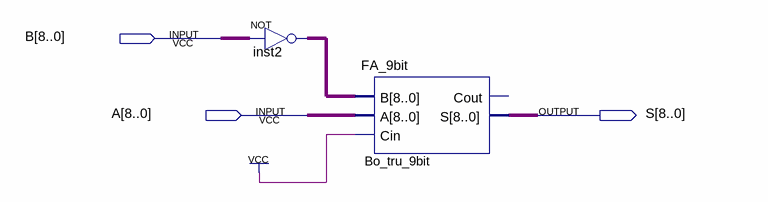
[diagram p0: schematic sheet]
// Quartus schematic BoTru_9bit.bdf as structural Verilog: 2 symbols, 3 pins
module BoTru_9bit (
  input  [8:0] B,
  input  [8:0] A,
  output [8:0] S
);

  wire [8:0] inst2_out;

  assign inst2_out = ~B;  // NOT inst2, 9 bits wide
  FA_9bit Bo_tru_9bit (.B(inst2_out), .A(A), .Cin(1'b1), .S(S));  // open: Cout
endmodule
